# Altium schematic sheet My_STM32_BOARD_FUNCTION_SCH.SchDoc
size A4
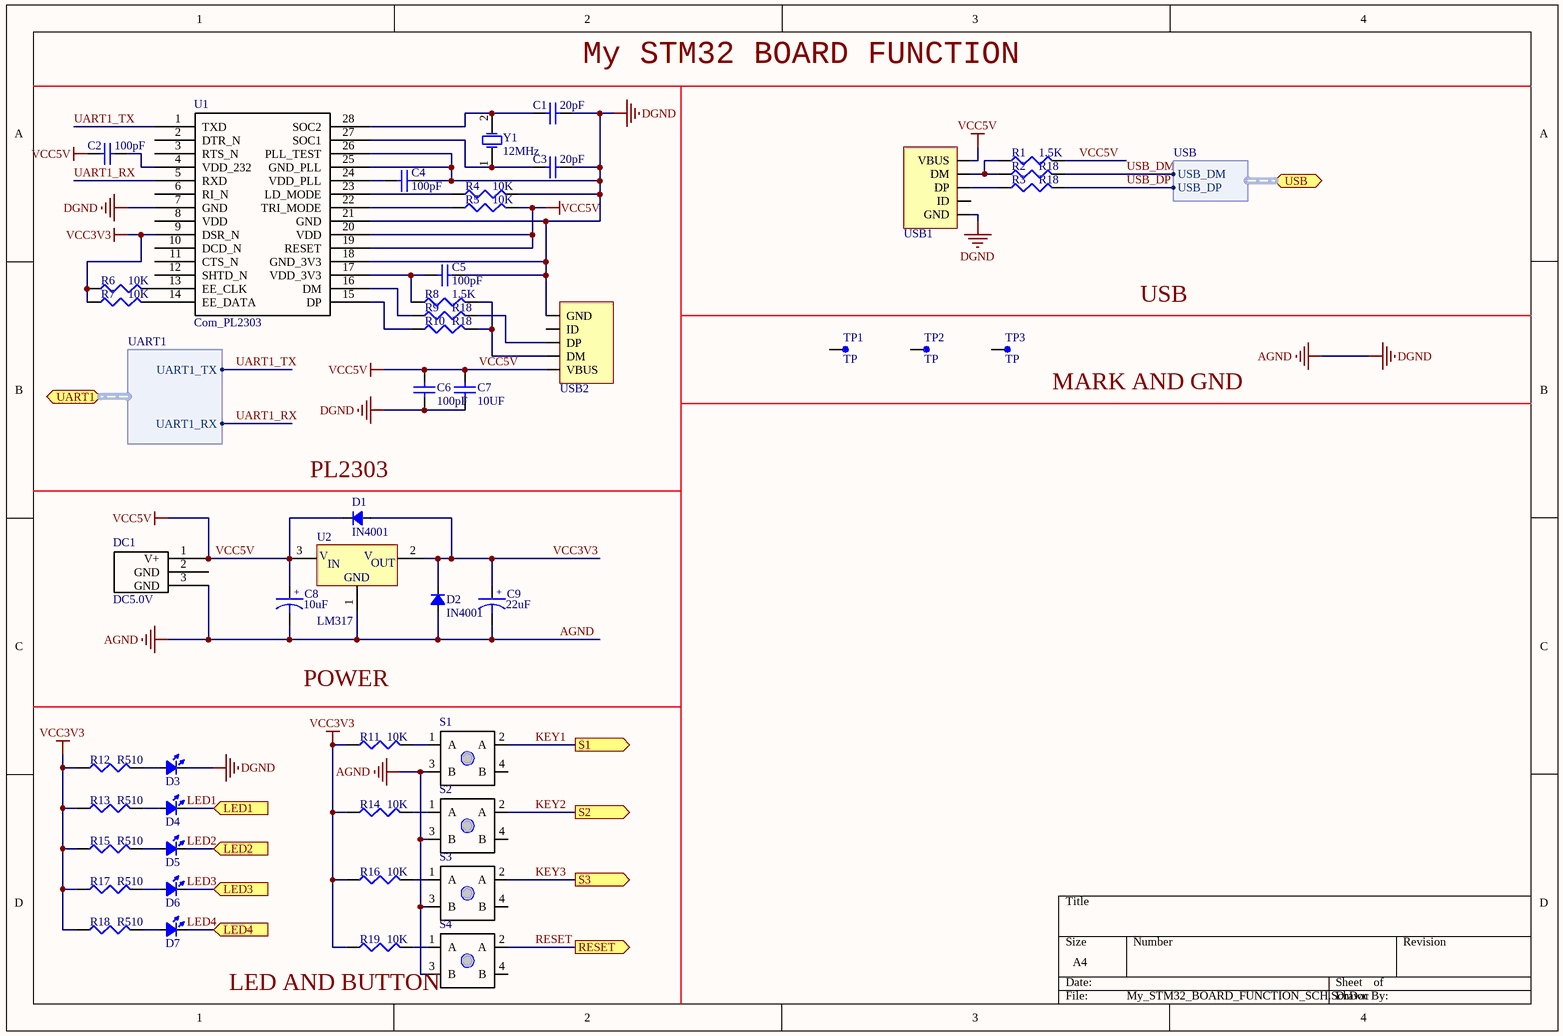
[diagram p0: My_STM32_BOARD_FUNCTION_SCH.SchDoc]

## Parts
C1  value 20pF  [0402]  (hidden comment: Cap)
C2  value 100pF  [0402]  (hidden comment: Cap)
C3  value 20pF  [0402]  (hidden comment: Cap)
C4  value 100pF  [0402]  (hidden comment: Cap)
C5  value 100pF  [0402]  (hidden comment: Cap)
C6  value 100pF  [0402]  (hidden comment: Cap)
C7  value 10UF  [2029]  (hidden comment: Cap)
C8  Cap_Pol  [Cap_Pol_F5]  (value not drawn)
C9  value 22uF  [Cap_Pol_F6]  (hidden comment: Cap_Pol)
D1  value IN4001  [DIODE_DO-214AC]
D2  value IN4001  [DIODE_DO-214AC]
D3  LED_0805  [LED_0805_RED]  (value not drawn)
D4  LED_0805  [LED_1206_BLUE]  (value not drawn)
D5  LED_0805  [LED_1206_BLUE]  (value not drawn)
D6  LED_0805  [LED_1206_BLUE]  (value not drawn)
D7  LED_0805  [LED_1206_BLUE]  (value not drawn)
DC1  DC5.0V  [DC_5V]
R1  value 1.5K  [6-0805_N]  (hidden comment: Res3)
R2  value R18  [6-0805_N]  (hidden comment: Res3)
R3  value R18  [6-0805_N]  (hidden comment: Res3)
R4  value 10K  [6-0805_N]  (hidden comment: Res3)
R5  value 10K  [6-0805_N]  (hidden comment: Res3)
R6  value 10K  [6-0805_N]  (hidden comment: Res3)
R7  value 10K  [6-0805_N]  (hidden comment: Res3)
R8  value 1.5K  [6-0805_N]  (hidden comment: Res3)
R9  value R18  [6-0805_N]  (hidden comment: Res3)
R10  value R18  [6-0805_N]  (hidden comment: Res3)
R11  value 10K  [6-0805_N]  (hidden comment: Res3)
R12  value R510  [6-0805_N]  (hidden comment: Res3)
R13  value R510  [6-0805_N]  (hidden comment: Res3)
R14  value 10K  [6-0805_N]  (hidden comment: Res3)
R15  value R510  [6-0805_N]  (hidden comment: Res3)
R16  value 10K  [6-0805_N]  (hidden comment: Res3)
R17  value R510  [6-0805_N]  (hidden comment: Res3)
R18  value R510  [6-0805_N]  (hidden comment: Res3)
R19  value 10K  [6-0805_N]  (hidden comment: Res3)
S1  Button  [My_Button]  (value not drawn)
S2  Button  [My_Button]  (value not drawn)
S3  Button  [My_Button]  (value not drawn)
S4  Button  [My_Button]  (value not drawn)
TP1  TP  [MARK]
TP2  TP  [MARK]
TP3  TP  [MARK]
U1  Com_PL2303  [SSOP-28]
U2  LM317  [lm1117]
USB1  USB_Mini  [USB_MINI-B]  (value not drawn)
USB2  USB_Mini  [USB_MINI-B]  (value not drawn)
Y1  value 12MHz  [XT_HC49S_D]  (hidden comment: XTAL)

## Ports
LED1 (in), LED2 (in), LED3 (in), LED4 (in), RESET (out), S1 (out), S2 (out), S3 (out), UART1 (harness UART1), USB (harness USB)

## Harnesses
UART1: UART1_TX, UART1_RX
USB: USB_DM, USB_DP

## Nets
AGND: C1.2 C3.2 C4.2 C5.2 C6.1 C7.1 C8.2 C9.2 D2.1(A) D3.2(K) DC1.3(GND) R4.2 S1.3(B) S2.3(B) S3.3(B) S4.3(B) U1.7(GND) U1.18(GND_3V3) U1.21(GND) U1.25(GND_PLL) U1.26(PLL_TEST) U2.1(GND) USB1.5(GND) USB2.5(GND)  [also labelled DGND]
VCC3V3: C9.1 D1.1(A) D2.2(K) R6.1 R7.1 R11.1 R12.1 R13.1 R14.1 R15.1 R16.1 R17.1 R18.1 R19.1 U1.9(DSR_N) U2.2(VOUT)
VCC5V: C2.2 C6.2 C7.2 C8.1 D1.2(K) DC1.1(V+) R1.2 R5.2 U1.19(RESET) U1.20(VDD) U2.3(VIN) USB1.1(VBUS) USB2.1(VBUS)
KEY1: S1.2(A) ; port S1
KEY2: S2.2(A) ; port S2
KEY3: S3.2(A) ; port S3
LED1: D4.2(K) ; port LED1
LED2: D5.2(K) ; port LED2
LED3: D6.2(K) ; port LED3
LED4: D7.2(K) ; port LED4
RESET: S4.2(A) ; port RESET
UART1_RX: U1.5(RXD) ; port UART1.UART1_RX
UART1_TX: U1.1(TXD) ; port UART1.UART1_TX
USB_DM: R2.2 ; port USB.USB_DM
USB_DP: R3.2 ; port USB.USB_DP
NetC1_1: C1.1 U1.28(SOC2) Y1.2
NetC2_1: C2.1 U1.4(VDD_232)
NetC3_1: C3.1 U1.27(SOC1) Y1.1
NetC4_1: C4.1 U1.24(VDD_PLL)
NetC5_1: C5.1 R8.1 U1.17(VDD_3V3)
NetD3_1: D3.1(A) R12.2
NetD4_1: D4.1(A) R13.2
NetD5_1: D5.1(A) R15.2
NetD6_1: D6.1(A) R17.2
NetD7_1: D7.1(A) R18.2
NetR1_1: R1.1 R2.1 USB1.2(DM)
NetR3_1: R3.1 USB1.3(DP)
NetR4_1: R4.1 U1.23(LD_MODE)
NetR5_1: R5.1 U1.22(TRI_MODE)
NetR6_2: R6.2 U1.13(EE_CLK)
NetR7_2: R7.2 U1.14(EE_DATA)
NetR8_2: R8.2 R10.2 USB2.2(DM)
NetR9_1: R9.1 U1.16(DM)
NetR9_2: R9.2 USB2.3(DP)
NetR10_1: R10.1 U1.15(DP)
NetR11_2: R11.2 S1.1(A)
NetR14_2: R14.2 S2.1(A)
NetR16_2: R16.2 S3.1(A)
NetR19_2: R19.2 S4.1(A)

Not connected (* = marked no-connect by the designer): DC1 2(GND); S1 4(B); S2 4(B); S3 4(B); S4 4(B); TP1 1; TP2 1; TP3 1; U1 2(DTR_N) 3(RTS_N) 6(RI_N) 8(VDD) 10(DCD_N) 11(CTS_N) 12(SHTD_N); USB1 4(ID); USB2 4(ID)

## Notes on the sheet
- (near C1) My STM32 BOARD FUNCTION
- USB
- (near TP3) MARK AND GND
- (near D1) PL2303
- POWER
- (near R19) LED AND BUTTON
- (in symbol Cap_Pol) +; 10uF
- (in symbol Power) V; IN; OUT

## Library data of the parts
C1-C7 = Cap: Capacitor; Published: 8-Jun-2000; LatestRevisionDate: 17-Jul-2002; LatestRevisionNote: Re-released for DXP Platform.; PackageReference: RAD-0.3; Publisher: Altium Limited; PackageDescription: Radial Cap, Thru-Hole; 2 Leads; 0.3 in Pin Spacing
C8 C9 = Cap_Pol: Capacitor
D1 D2 = Diode_SMA: Diode
D3-D7 = LED_0805: LED
DC1 = DC5V
R1-R19 = Res3: Resistor; Published: 8-Jun-2000; LatestRevisionDate: 29-May-2009; LatestRevisionNote: IPC-7351 Footprint Added.; PackageReference: J1-0603; Publisher: Altium Limited; PackageDescription: Chip Resistor
S1-S4 = KEY: 四脚按键
U1 = Com_PL2303: PL2303
U2 = Power: LM317 电源芯片
USB1 USB2 = USB_Mini: USB